# EAGLE design 8j-merge2 (EAGLE 6.6.0)
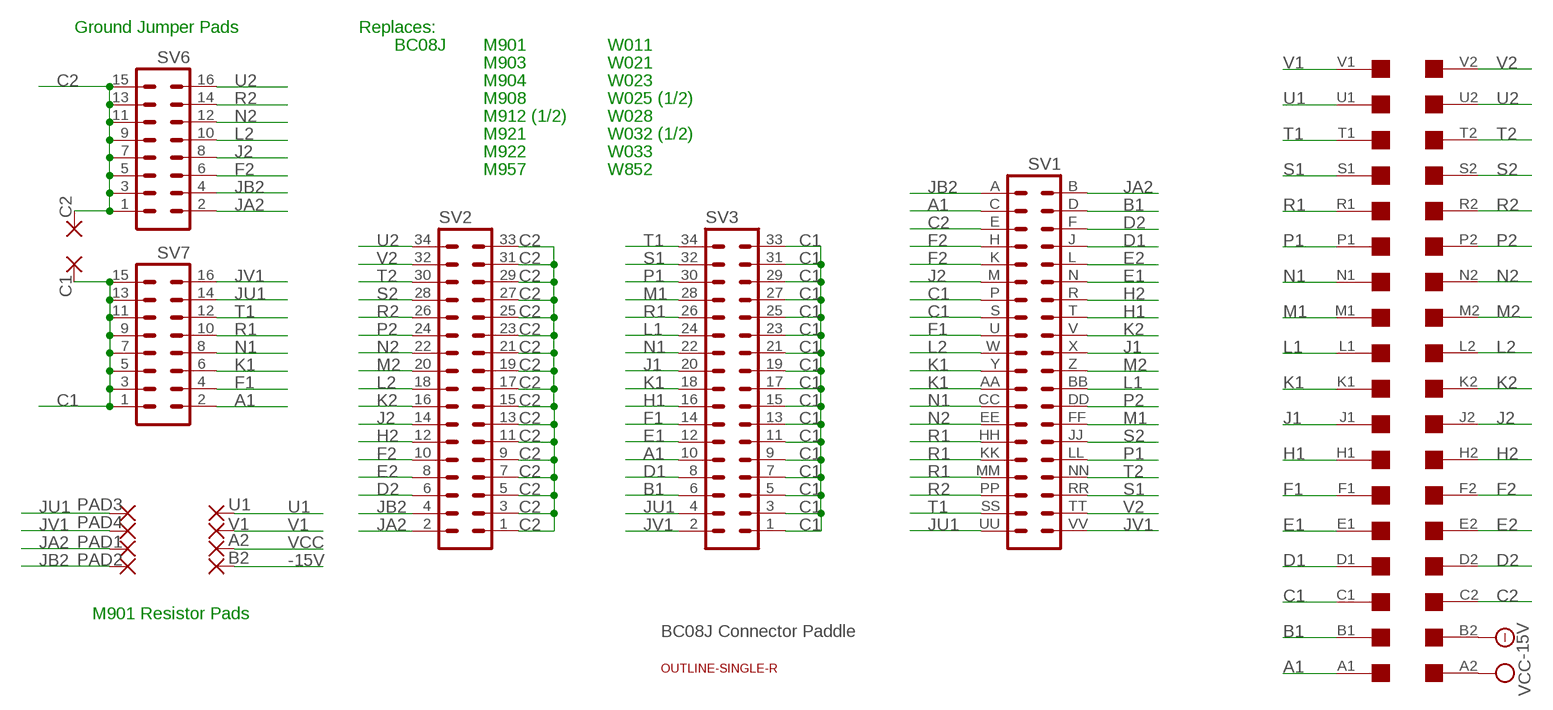
[diagram p0: schematic, sheet 1]

## Parts
A2  1,6/0,8  [1,6/0,8]
B2  1,6/0,8  [1,6/0,8]
C1  1,6/0,8  [1,6/0,8]
C2  1,6/0,8  [1,6/0,8]
PAD1  1,6/0,8  [1,6/0,8]
PAD2  1,6/0,8  [1,6/0,8]
PAD3  1,6/0,8  [1,6/0,8]
PAD4  1,6/0,8  [1,6/0,8]
SV1  DEC40PINV  [DEC40PINV]
SV2  MA17-2  [MA17-2]
SV3  MA17-2  [MA17-2]
SV6  MA08-2  [MA08-2]
SV7  MA08-2  [MA08-2]
U1  1,6/0,8  [1,6/0,8]
U$1  OUTLINE-SINGLE-R  [SINGLE-R]
U$2  SINGLE  [EDGE-CON2]
V1  1,6/0,8  [1,6/0,8]

## Nets
-15V: B2.1(P) U$2.B2
A1: SV1.C SV3.10 SV7.2 U$2.A1
B1: SV1.D SV3.6 U$2.B1
C1: C1.1(P) SV1.P SV1.S SV3.1 SV3.3 SV3.5 SV3.7 SV3.9 SV3.11 SV3.13 SV3.15 SV3.17 SV3.19 SV3.21 SV3.23 SV3.25 SV3.27 SV3.29 SV3.31 SV3.33 SV7.1 SV7.3 SV7.5 SV7.7 SV7.9 SV7.11 SV7.13 SV7.15 U$2.C1
C2: C2.1(P) SV1.E SV2.1 SV2.3 SV2.5 SV2.7 SV2.9 SV2.11 SV2.13 SV2.15 SV2.17 SV2.19 SV2.21 SV2.23 SV2.25 SV2.27 SV2.29 SV2.31 SV2.33 SV6.1 SV6.3 SV6.5 SV6.7 SV6.9 SV6.11 SV6.13 SV6.15 U$2.C2
D1: SV1.J SV3.8 U$2.D1
D2: SV1.F SV2.6 U$2.D2
E1: SV1.N SV3.12 U$2.E1
E2: SV1.L SV2.8 U$2.E2
F1: SV1.U SV3.14 SV7.4 U$2.F1
F2: SV1.H SV1.K SV2.10 SV6.6 U$2.F2
H1: SV1.T SV3.16 U$2.H1
H2: SV1.R SV2.12 U$2.H2
J1: SV1.X SV3.20 U$2.J1
J2: SV1.M SV2.14 SV6.8 U$2.J2
JA2: PAD1.1(P) SV1.B SV2.2 SV6.2
JB2: PAD2.1(P) SV1.A SV2.4 SV6.4
JU1: PAD3.1(P) SV1.UU SV3.4 SV7.14
JV1: PAD4.1(P) SV1.VV SV3.2 SV7.16
K1: SV1.AA SV1.Y SV3.18 SV7.6 U$2.K1
K2: SV1.V SV2.16 U$2.K2
L1: SV1.BB SV3.24 U$2.L1
L2: SV1.W SV2.18 SV6.10 U$2.L2
M1: SV1.FF SV3.28 U$2.M1
M2: SV1.Z SV2.20 U$2.M2
N1: SV1.CC SV3.22 SV7.8 U$2.N1
N2: SV1.EE SV2.22 SV6.12 U$2.N2
P1: SV1.LL SV3.30 U$2.P1
P2: SV1.DD SV2.24 U$2.P2
R1: SV1.HH SV1.KK SV1.MM SV3.26 SV7.10 U$2.R1
R2: SV1.PP SV2.26 SV6.14 U$2.R2
S1: SV1.RR SV3.32 U$2.S1
S2: SV1.JJ SV2.28 U$2.S2
T1: SV1.SS SV3.34 SV7.12 U$2.T1
T2: SV1.NN SV2.30 U$2.T2
U1: U1.1(P) U$2.U1
U2: SV2.34 SV6.16 U$2.U2
V1: U$2.V1 V1.1(P)
V2: SV1.TT SV2.32 U$2.V2
VCC: A2.1(P) U$2.A2

## Notes on the sheet
- Ground Jumper Pads | Replaces:
- BC08J | M901 | W011
- M903 | W021
- M904 | W023
- M908 | W025 (1/2)
- M912 (1/2) | W028
- M921 | W032 (1/2)
- M922 | W033
- M957 | W852
- M901 Resistor Pads
- BC08J Connector Paddle

## Library data of the parts
A2 B2 C1 C2 PAD1-PAD4 U1 V1 = wirepad:1,6/0,8: THROUGH-HOLE PAD
SV1 = dec-con:DEC40PIN: PIN HEADER
SV2 SV3 = con-lstb:MA17-2: PIN HEADER; OC_FARNELL: unknown; OC_NEWARK: unknown
SV6 SV7 = con-lstb:MA08-2: PIN HEADER; OC_FARNELL: unknown; OC_NEWARK: unknown
U$1 = dec-con:OUTLINE-*: Board outlines for DEC boards.
U$2 = dec-con:SINGLE: Single-Height DEC board

## Board
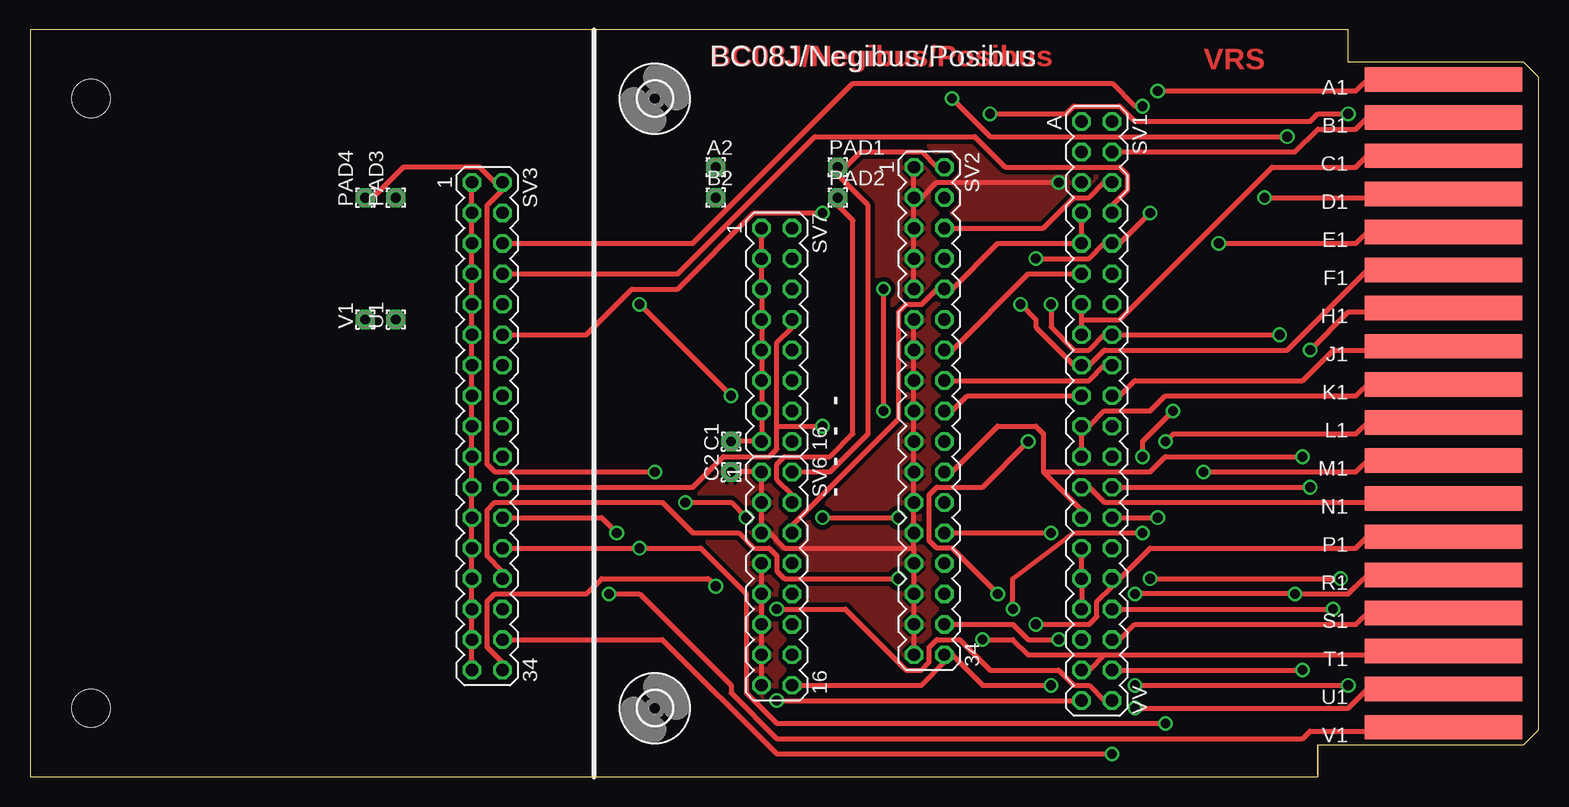
[diagram p1: board, top side]
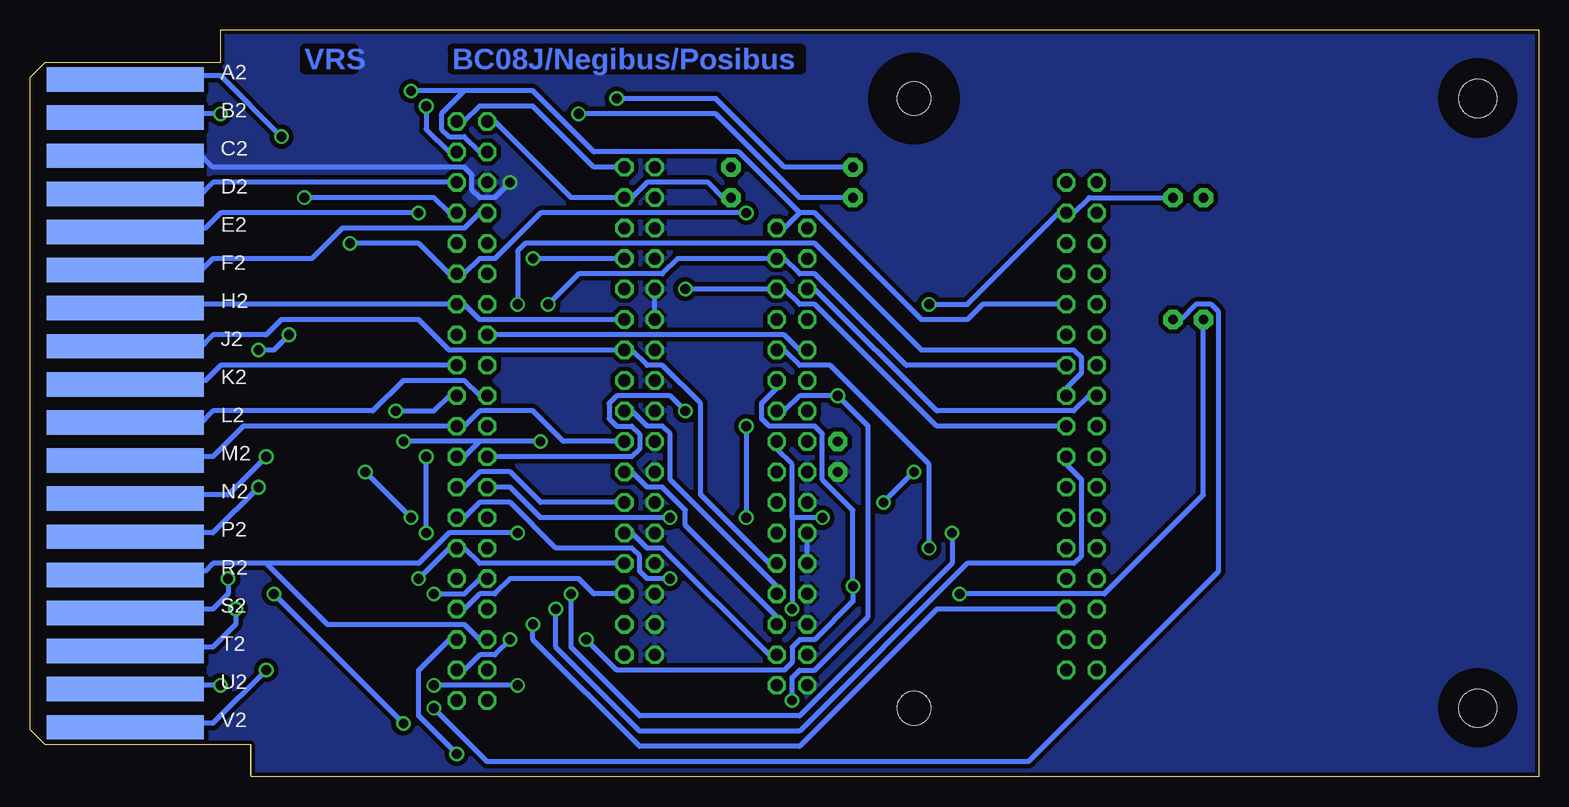
[diagram p2: board, bottom side, seen from below]

Size 125.73 x 62.23 mm. Coordinates in mm from the lower left corner, seen from the top.
Copper layers (1+16): Top 0.035mm / dielectric 1.5mm / Bottom 0.035mm
Design rules "16mils": minimum track width 16mil, minimum drill 32mil, track to track 15mil, track to pad 10mil, pad to pad 10mil, via to via 10mil, smd to smd 10mil, copper to edge 13mil, drill to drill 10mil, minimum pad ring 10mil, minimum via ring 8mil, stop-mask expansion 0mil, vias tented up to drill 0mil, thermal gap 10mil
bRestrict: area 2.2,2.9 to 7.9,8.6; area 2.2,53.7 to 7.9,59.4

### Footprints (pad centres in the part's own frame; a part is rotated, then mirrored left to right if it is on the bottom)
1,6/0,8 = drill 0.813 pad 1.6 octagon: 1 0,0
DEC40PINV = drill 1.016 octagon: A -24.13,-1.27; AA 3.81,-1.27; B -24.13,1.27; BB 3.81,1.27; C -21.59,-1.27; CC 6.35,-1.27; D -21.59,1.27; DD 6.35,1.27; E -19.05,-1.27; EE 8.89,-1.27; F -19.05,1.27; FF 8.89,1.27; H -16.51,-1.27; HH 11.43,-1.27; J -16.51,1.27; JJ 11.43,1.27; K -13.97,-1.27; KK 13.97,-1.27; L -13.97,1.27; LL 13.97,1.27; M -11.43,-1.27; MM 16.51,-1.27; N -11.43,1.27; NN 16.51,1.27; P -8.89,-1.27; PP 19.05,-1.27; R -8.89,1.27; RR 19.05,1.27; S -6.35,-1.27; SS 21.59,-1.27; T -6.35,1.27; TT 21.59,1.27; U -3.81,-1.27; UU 24.13,-1.27; V -3.81,1.27; VV 24.13,1.27; W -1.27,-1.27; X -1.27,1.27; Y 1.27,-1.27; Z 1.27,1.27
MA17-2 = drill 1.016 octagon: 1 -20.32,-1.27; 2 -20.32,1.27; 3 -17.78,-1.27; 4 -17.78,1.27; 5 -15.24,-1.27; 6 -15.24,1.27; 7 -12.7,-1.27; 8 -12.7,1.27; 9 -10.16,-1.27; 10 -10.16,1.27; 11 -7.62,-1.27; 12 -7.62,1.27; 13 -5.08,-1.27; 14 -5.08,1.27; 15 -2.54,-1.27; 16 -2.54,1.27; 17 0,-1.27; 18 0,1.27; 19 2.54,-1.27; 20 2.54,1.27; 21 5.08,-1.27; 22 5.08,1.27; 23 7.62,-1.27; 24 7.62,1.27; 25 10.16,-1.27; 26 10.16,1.27; 27 12.7,-1.27; 28 12.7,1.27; 29 15.24,-1.27; 30 15.24,1.27; 31 17.78,-1.27; 32 17.78,1.27; 33 20.32,-1.27; 34 20.32,1.27
MA08-2 = drill 1.016 octagon: 1 -8.89,-1.27; 2 -8.89,1.27; 3 -6.35,-1.27; 4 -6.35,1.27; 5 -3.81,-1.27; 6 -3.81,1.27; 7 -1.27,-1.27; 8 -1.27,1.27; 9 1.27,-1.27; 10 1.27,1.27; 11 3.81,-1.27; 12 3.81,1.27; 13 6.35,-1.27; 14 6.35,1.27; 15 8.89,-1.27; 16 8.89,1.27
SINGLE-R = hole 3.175: 5.08,5.715; 5.08,56.515
EDGE-CON2 = smd 13.106 x 2.032: A1 7.938,4.128; B1 7.938,7.303; C1 7.938,10.477; D1 7.938,13.652; E1 7.938,16.828; F1 7.938,20.003; H1 7.938,23.177; J1 7.938,26.352; K1 7.938,29.527; L1 7.938,32.703; M1 7.938,35.877; N1 7.938,39.053; P1 7.938,42.227; R1 7.938,45.403; S1 7.938,48.578; T1 7.938,51.752; U1 7.938,54.928; V1 7.938,58.102 | smd 13.106 x 2.032 bottom: A2 7.938,4.128; B2 7.938,7.303; C2 7.938,10.477; D2 7.938,13.652; E2 7.938,16.828; F2 7.938,20.003; H2 7.938,23.177; J2 7.938,26.352; K2 7.938,29.527; L2 7.938,32.703; M2 7.938,35.877; N2 7.938,39.053; P2 7.938,42.227; R2 7.938,45.403; S2 7.938,48.578; T2 7.938,51.752; U2 7.938,54.928; V2 7.938,58.102
2,8 = hole 2.8: 0,0

### Placement (x,y rotation side)
A2  57.15,50.8 0 top
B2  57.15,48.26 0 top
C1  58.42,27.94 90 top
C2  58.42,25.4 90 top
PAD1  67.31,50.8 0 top
PAD2  67.31,48.26 0 top
PAD3  30.48,48.26 90 top
PAD4  27.94,48.26 90 top
SV1  88.9,30.48 270 top
SV2  74.93,30.48 270 top
SV3  38.1,29.21 270 top
SV6  62.23,16.51 270 top
SV7  62.23,36.83 270 top
U1  30.48,38.1 90 top
U$1  0,0 0 top
U$2  125.73,62.23 180 top
U$3  [2,8]  52.07,56.52 0 top
U$4  [2,8]  52.07,5.71 0 top
V1  27.94,38.1 90 top

### Tracks (layer width: path | path; a pad name or v marks a point on that pad's centre or on a via)
-15V  (via drill 0.81)
  Top 0.406: v80.01,55.24 86.36,55.24 87,55.88 90.81,55.88 92.08,54.61 106.68,54.61 107.31,55.24 v109.86,55.24
  Bottom 0.406: B2.1 61.59,48.26 68.58,55.24 v80.01,55.24 | v109.86,55.24 111.76,55.24 U$2.B2
A1  (via drill 0.81)
  Top 0.406: v93.98,57.15 110.49,57.15 111.76,58.42 U$2.A1
  Bottom 0.406: SV3.10 46.35,39.37 47.62,38.1 51.44,38.1 60.33,46.99 61.59,46.99 | 61.59,46.99 62.87,45.72 SV7.2 | 89.53,57.15 91.44,55.24 91.44,53.98 90.81,53.34 89.53,53.34 88.27,52.07 SV1.C | 89.53,57.15 83.82,57.15 78.74,52.07 66.67,52.07 61.59,46.99 | 89.53,57.15 v93.98,57.15
B1  (via drill 0.81)
  Top 0.406: SV3.6 55.24,44.45 68.58,57.78 90.17,57.78 92.08,55.88 v92.71,55.88 | SV1.D 105.41,52.07 107.31,53.98 110.49,53.98 111.76,55.24 U$2.B1
  Bottom 0.406: v92.71,55.88 92.71,53.98 90.81,52.07 SV1.D
C1
  Top 0.406: SV3.33 SV3.31 SV3.29 SV3.27 SV3.25 SV3.23 SV3.21 SV3.19 SV3.17 SV3.15 SV3.13 SV3.11 SV3.9 SV3.7 SV3.5 SV3.3 SV3.1 | SV1.S 87.63,38.1 | 87.63,38.1 SV1.P | C1.1 SV7.15 SV7.13 SV7.11 SV7.9 SV7.7 SV7.5 SV7.3 SV7.1 | 87.63,38.1 90.81,38.1 103.5,50.8 110.49,50.8 111.76,52.07 U$2.C1
  Bottom 0.406: SV1.S 62.87,36.83 61.59,35.56 SV7.9 | SV3.15 37.47,31.75 38.73,30.48 50.16,30.48 60.33,40.64 SV7.5
C2  (via drill 0.81)
  Top 0.406: SV6.15 SV6.13 SV6.11 SV6.9 SV6.7 | C2.1 SV6.1 SV6.3 SV6.5 61.59,20.32 62.87,19.05 73.66,19.05 | SV2.33 SV2.31 SV2.29 SV2.27 73.66,19.05 | 73.66,19.05 SV2.25 SV2.23 SV2.21 SV2.19 SV2.17 SV2.15 SV2.13 SV2.11 | SV2.9 SV2.7 SV2.5 SV2.3 | SV2.3 SV2.1 | v85.72,49.53 75.56,49.53 74.3,48.26 SV2.3
  Bottom 0.406: SV6.7 SV6.5 | SV2.11 SV2.9 | v85.72,49.53 87,48.26 88.27,48.26 88.9,48.9 88.9,50.16 89.53,50.8 110.49,50.8 111.76,52.07 U$2.C2
  pour Bottom (isolate 0.254): 0,0 111.76,0 111.76,62.23 0,62.23
  pour Top (isolate 0.254): 0,0 111.76,0 111.76,62.23 0,62.23
D1  (via drill 0.81)
  Top 0.406: SV3.8 40.01,41.91 53.98,41.91 65.41,53.34 78.74,53.34 81.28,50.8 90.81,50.8 91.44,50.16 91.44,48.9 90.17,47.62 SV1.J | v102.87,48.26 111.76,48.26 U$2.D1
  Bottom 0.406: v102.87,48.26 92.08,48.26 90.81,46.99 SV1.J
D2
  Top 0.406: SV2.6 84.45,45.72 87,48.26 88.27,48.26 89.53,49.53 SV1.F
  Bottom 0.406: SV1.F 110.49,49.53 111.76,48.26 U$2.D2
E1  (via drill 0.81)
  Top 0.406: SV3.12 46.35,36.83 50.16,40.64 53.98,40.64 60.33,46.99 v66.04,46.99 | v99.06,44.45 110.49,44.45 111.76,45.72 U$2.E1
  Bottom 0.406: v66.04,46.99 83.19,46.99 87,43.18 88.27,43.18 89.53,41.91 SV1.N 90.81,41.91 93.34,44.45 v99.06,44.45
E2  (via drill 0.81)
  Top 0.406: v83.82,43.18 88.27,43.18 89.53,44.45 SV1.L 90.81,44.45 v93.34,46.99
  Bottom 0.406: SV2.8 v83.82,43.18 | v93.34,46.99 109.86,46.99 111.12,45.72 U$2.E2
F1  (via drill 0.81)
  Top 0.406: U$2.F1 111.76,42.55 104.78,35.56 89.53,35.56 88.27,34.29 SV1.U 87,34.29 83.82,37.47 83.82,38.1 v82.55,39.37
  Bottom 0.406: SV3.14 40.01,34.29 52.7,34.29 60.33,41.91 61.59,41.91 62.87,43.18 SV7.4 64.14,43.18 71.75,43.18 73.03,41.91 80.01,41.91 v82.55,39.37
F2
  Top 0.406: SV1.H SV1.K 80.64,44.45 76.83,40.64 SV2.10 75.56,40.64 74.3,39.37 73.03,39.37 72.39,38.73 72.39,29.84 63.5,20.95 SV6.6
  Bottom 0.406: U$2.F2 111.76,41.91 110.49,43.18 102.23,43.18 99.69,45.72 89.53,45.72 88.27,46.99 SV1.H
H1  (via drill 0.81)
  Top 0.406: v85.09,39.37 85.09,37.47 87,35.56 88.27,35.56 89.53,36.83 SV1.T v104.14,36.83 | v106.68,35.56 109.86,38.73 112.39,38.73 U$2.H1
  Bottom 0.406: v85.09,39.37 85.09,43.81 84.45,44.45 60.33,44.45 51.44,35.56 38.73,35.56 38.1,34.92 38.1,33.66 39.37,32.38 SV3.16 | v106.68,35.56 105.41,35.56 v104.14,36.83
H2
  Bottom 0.406: SV2.12 76.83,38.1 88.27,38.1 89.53,39.37 SV1.R 90.81,39.37 111.76,39.37 U$2.H2
J1  (via drill 0.81)
  Top 0.406: v81.92,13.97 81.92,16.51 87,20.32 v92.71,20.32 | v92.71,26.67 92.71,27.94 v95.25,30.48 | U$2.J1 112.39,35.56 108.58,35.56 106.05,33.02 92.08,33.02 90.81,31.75 SV1.X
  Bottom 0.406: v81.92,13.97 81.92,10.79 74.93,3.81 61.59,3.81 47.62,17.78 38.73,17.78 38.1,18.41 38.1,24.77 39.37,26.04 SV3.20 | v92.71,20.32 v92.71,26.67 | v95.25,30.48 92.08,30.48 90.81,31.75 SV1.X
J2
  Top 0.406: SV1.M 83.19,41.91 76.83,35.56 SV2.14
  Bottom 0.406: SV6.8 64.14,17.78 69.85,23.5 69.85,31.11 73.03,34.29 74.3,34.29 75.56,35.56 SV2.14 90.81,35.56 93.34,38.1 104.78,38.1 106.05,36.83 110.49,36.83 111.76,35.56 U$2.J2
JA2
  Top 0.406: SV6.2 64.14,25.4 66.67,25.4 69.85,28.57 69.85,47.62 67.31,50.16 PAD1.1 67.94,50.8 69.22,52.07 74.3,52.07 75.56,50.8 SV2.2
  Bottom 0.406: SV1.B 89.53,54.61 88.27,55.88 83.82,55.88 78.74,50.8 76.83,50.8 SV2.2
JB2
  Top 0.406: SV6.4 63.5,23.5 62.23,24.77 62.23,26.04 62.87,26.67 66.67,26.67 68.58,28.57 68.58,46.35 67.31,47.62 PAD2.1
  Bottom 0.406: SV1.A 87,54.61 80.64,48.26 76.83,48.26 SV2.4 75.56,48.26 74.3,49.53 69.22,49.53 67.94,48.26 PAD2.1
JU1  (via drill 0.81)
  Top 0.406: v58.42,31.75 v50.8,39.37 | v62.23,6.35 87,6.35 SV1.UU
  Bottom 0.406: v50.8,39.37 47.62,39.37 40.01,46.99 SV3.4 38.73,46.99 37.47,48.26 31.11,48.26 PAD3.1 | SV7.14 62.87,30.48 61.59,31.75 v58.42,31.75 55.88,29.21 55.88,13.34 60.33,8.89 61.59,8.89 62.23,8.26 v62.23,6.35
JV1  (via drill 0.81)
  Top 0.406: PAD4.1 28.57,48.26 31.11,50.8 37.47,50.8 38.73,49.53 SV3.2 39.37,48.9 38.1,47.62 38.1,26.04 38.73,25.4 v52.07,25.4 | v62.23,13.97 67.94,13.97 73.03,8.89 74.3,8.89 74.93,9.53 74.93,10.79 75.56,11.43 77.47,11.43 80.01,8.89 85.72,8.89 87,7.62 88.27,7.62 89.53,6.35 SV1.VV | v54.61,22.86 58.42,22.86 v59.69,21.59
  Bottom 0.406: 62.23,21.59 v62.23,13.97 | 62.23,21.59 62.23,26.04 63.5,27.3 SV7.16 | v52.07,25.4 v54.61,22.86 | v59.69,21.59 62.23,21.59
K1  (via drill 0.81)
  Top 0.406: SV1.AA SV1.Y 88.27,29.21 89.53,30.48 93.34,30.48 94.61,31.75 110.49,31.75 111.76,33.02 U$2.K1 | v71.12,40.64 v71.12,30.48
  Bottom 0.406: SV3.18 50.16,29.21 60.33,39.37 61.59,39.37 62.87,40.64 SV7.6 v71.12,40.64 | v71.12,30.48 72.39,31.75 76.83,31.75 77.47,31.11 77.47,29.84 76.83,29.21 75.56,29.21 74.93,28.57 74.93,27.3 75.56,26.67 SV1.AA
K2
  Top 0.406: SV2.16 88.27,33.02 89.53,34.29 SV1.V
  Bottom 0.406: SV1.V 109.86,34.29 111.12,33.02 U$2.K2
L1  (via drill 0.81)
  Top 0.406: SV3.24 47.62,21.59 v48.9,20.32 | v80.64,15.24 76.83,19.05 75.56,19.05 74.93,19.68 74.93,23.5 75.56,24.13 79.38,24.13 v83.19,27.94 | v94.61,27.94 95.25,28.57 110.49,28.57 111.76,29.84 U$2.L1
  Bottom 0.406: v48.9,20.32 48.9,17.78 61.59,5.08 74.93,5.08 80.64,10.79 v80.64,15.24 | v83.19,27.94 88.27,27.94 | 88.27,27.94 89.53,26.67 SV1.BB | 88.27,27.94 v94.61,27.94
L2
  Top 0.406: SV1.W 78.11,31.75 76.83,30.48 SV2.18
  Bottom 0.406: SV6.10 63.5,15.88 72.39,24.77 72.39,28.57 73.03,29.21 74.3,29.21 75.56,30.48 SV2.18 | U$2.L2 111.76,29.21 110.49,30.48 97.16,30.48 94.61,33.02 89.53,33.02 88.27,31.75 SV1.W
M1  (via drill 0.81)
  Top 0.406: v72.39,16.51 62.87,16.51 62.23,17.14 62.23,18.41 61.59,19.05 60.33,19.05 59.05,20.32 55.24,20.32 52.7,22.86 38.73,22.86 38.1,22.23 38.1,18.41 39.37,17.14 SV3.28 | v97.79,25.4 110.49,25.4 111.76,26.67 U$2.M1 | SV1.FF v93.98,21.59
  Bottom 0.406: v72.39,16.51 74.3,16.51 74.93,17.14 74.93,18.41 75.56,19.05 81.92,19.05 85.72,22.86 88.27,22.86 89.53,21.59 SV1.FF | v93.98,21.59 v97.79,25.4
M2
  Bottom 0.406: SV2.20 81.28,27.94 83.82,30.48 88.27,30.48 89.53,29.21 SV1.Z 107.95,29.21 110.49,26.67 111.76,26.67 U$2.M2
N1  (via drill 0.81)
  Top 0.406: 62.23,29.21 62.23,36.2 63.5,37.47 SV7.8 | 62.23,29.21 62.23,27.3 61.59,26.67 57.78,26.67 55.24,24.13 40.01,24.13 SV3.22 | SV1.CC 88.27,24.13 89.53,22.86 111.76,22.86 U$2.N1 | 62.23,29.21 v66.04,29.21 | v66.04,21.59 v72.39,21.59
  Bottom 0.406: v66.04,29.21 v66.04,21.59 | v72.39,21.59 83.19,21.59 85.72,24.13 87,24.13 SV1.CC
N2  (via drill 0.81)
  Top 0.406: 84.45,25.4 87.63,22.23 SV1.EE | 84.45,25.4 84.45,28.57 83.82,29.21 80.64,29.21 76.83,25.4 SV2.22 | v106.05,26.67 94.61,26.67 93.34,25.4 84.45,25.4
  Bottom 0.406: SV6.12 63.5,13.34 71.12,20.95 71.12,22.23 73.03,24.13 74.3,24.13 75.56,25.4 SV2.22 | v106.05,26.67 109.22,23.5 112.39,23.5 U$2.N2
P1  (via drill 0.81)
  Top 0.406: v83.82,12.7 88.27,12.7 88.9,13.34 88.9,14.61 90.17,15.88 SV1.LL 90.81,16.51 93.34,19.05 110.49,19.05 111.76,20.32 U$2.P1
  Bottom 0.406: SV3.30 50.16,13.97 61.59,2.54 74.93,2.54 83.82,11.43 v83.82,12.7
P2  (via drill 0.81)
  Top 0.406: SV1.DD v106.68,24.13
  Bottom 0.406: SV2.24 83.19,22.86 85.72,25.4 88.27,25.4 89.53,24.13 SV1.DD | v106.68,24.13 110.49,20.32 111.76,20.32 U$2.P2
R1  (via drill 0.81)
  Top 0.406: SV1.MM SV1.KK SV1.HH | v92.08,15.24 v105.41,15.24 109.86,15.24 110.49,15.88 111.76,17.14 U$2.R1 | SV3.26 v50.8,19.05 55.88,19.05 59.69,15.24 59.69,6.99 62.23,4.45 v94.61,4.45
  Bottom 0.406: v92.08,15.24 89.53,15.24 88.27,16.51 SV1.KK | v94.61,4.45 v105.41,15.24 | v50.8,19.05 50.8,26.04 59.05,34.29 61.59,34.29 62.87,35.56 SV7.10
R2  (via drill 0.81)
  Top 0.406: SV2.26 v85.09,20.32
  Bottom 0.406: SV6.14 64.14,10.16 73.03,19.05 74.3,19.05 75.56,20.32 SV2.26 | 106.05,17.78 100.97,12.7 89.53,12.7 88.27,11.43 SV1.PP | 106.05,17.78 110.49,17.78 111.12,17.14 111.76,17.14 U$2.R2 | v85.09,20.32 90.81,20.32 93.34,17.78 106.05,17.78
S1  (via drill 0.81)
  Top 0.406: SV3.32 52.7,11.43 62.23,1.91 v90.17,1.91 | U$2.S1 111.76,13.97 110.49,12.7 92.08,12.7 90.81,11.43 SV1.RR
  Bottom 0.406: v90.17,1.91 93.34,5.08 93.34,8.89 90.81,11.43 SV1.RR
S2  (via drill 0.81)
  Top 0.406: v93.34,16.51 v109.22,16.51
  Bottom 0.406: SV2.28 76.83,17.78 88.27,17.78 89.53,19.05 SV1.JJ 90.81,19.05 v93.34,16.51 | v109.22,16.51 109.22,15.24 110.49,13.97 111.76,13.97 U$2.S2
T1  (via drill 0.81)
  Top 0.406: v57.15,15.88 56.52,16.51 47.62,16.51 46.35,15.24 38.73,15.24 38.1,14.61 38.1,10.79 39.37,9.53 SV3.34 | 89.53,10.16 88.27,8.89 SV1.SS | 89.53,10.16 111.76,10.16 U$2.T1 | v79.38,11.43 81.92,11.43 83.19,10.16 89.53,10.16
  Bottom 0.406: SV7.12 63.5,32.38 64.77,31.11 64.77,29.84 64.14,29.21 60.33,29.21 59.69,28.57 59.69,24.77 57.15,22.23 v57.15,15.88 57.15,14.61 60.33,11.43 61.59,11.43 62.23,10.79 62.23,9.53 62.87,8.89 76.83,8.89 v79.38,11.43
T2  (via drill 0.81)
  Top 0.406: v108.58,13.97 90.81,13.97 SV1.NN
  Bottom 0.406: SV2.30 76.83,15.24 78.74,15.24 80.01,16.51 85.72,16.51 87,15.24 88.27,15.24 89.53,13.97 SV1.NN | v108.58,13.97 108.58,12.7 110.49,10.79 111.76,10.79 U$2.T2
U1  (via drill 0.81)
  Top 0.406: v92.08,5.71 109.86,5.71 111.76,7.62 U$2.U1
  Bottom 0.406: v92.08,5.71 87.63,1.27 42.55,1.27 26.67,17.14 26.67,38.73 27.3,39.37 28.57,39.37 29.84,38.1 U1.1
U2  (via drill 0.81)
  Top 0.406: SV6.16 74.3,7.62 76.2,9.53 SV2.34 76.83,10.16 79.38,7.62 v85.09,7.62 | v92.08,7.62 v109.86,7.62
  Bottom 0.406: v85.09,7.62 v92.08,7.62 | v109.86,7.62 111.76,7.62 U$2.U2
V1  (via drill 0.81)
  Top 0.406: v48.26,15.24 50.8,15.24 58.42,7.62 58.42,6.99 62.23,3.17 106.05,3.17 106.68,3.81 111.76,3.81 U$2.V1
  Bottom 0.406: v48.26,15.24 36.2,15.24 27.94,23.5 27.94,37.47 V1.1
V2  (via drill 0.81)
  Top 0.406: SV1.TT v106.05,8.89 | SV2.32 81.92,12.7 83.19,11.43 v85.72,11.43
  Bottom 0.406: v106.05,8.89 110.49,4.45 111.76,4.45 U$2.V2 | v85.72,11.43 87,10.16 88.27,10.16 89.53,8.89 SV1.TT
VCC  (via drill 0.81)
  Top 0.406: v76.83,56.52 80.01,53.34 v104.78,53.34
  Bottom 0.406: A2.1 62.87,50.8 68.58,56.52 v76.83,56.52 | v104.78,53.34 109.86,58.42 111.76,58.42 U$2.A2

### Text on the board
Top: BC08J/Negibus/Posibus | VRS
Bottom: BC08J/Negibus/Posibus | VRS
tPlace: BC08J/Negibus/Posibus | - | - | - | -
tValues: * | * | * | * | * | * | * | * | * | * | * | * | Side 1 | Side 2 | * | * | * | * | * | * | * | BC08J | * | * | * | * | * | * | * | * | * | * | * | * | * | * | * | * | *
tDocu: Requires top silkscreen. | Requires soldermask, both sides.